# Altium schematic sheet misc_schem.SchDoc
size A4; SheetNumber: 2; SheetTotal: 2
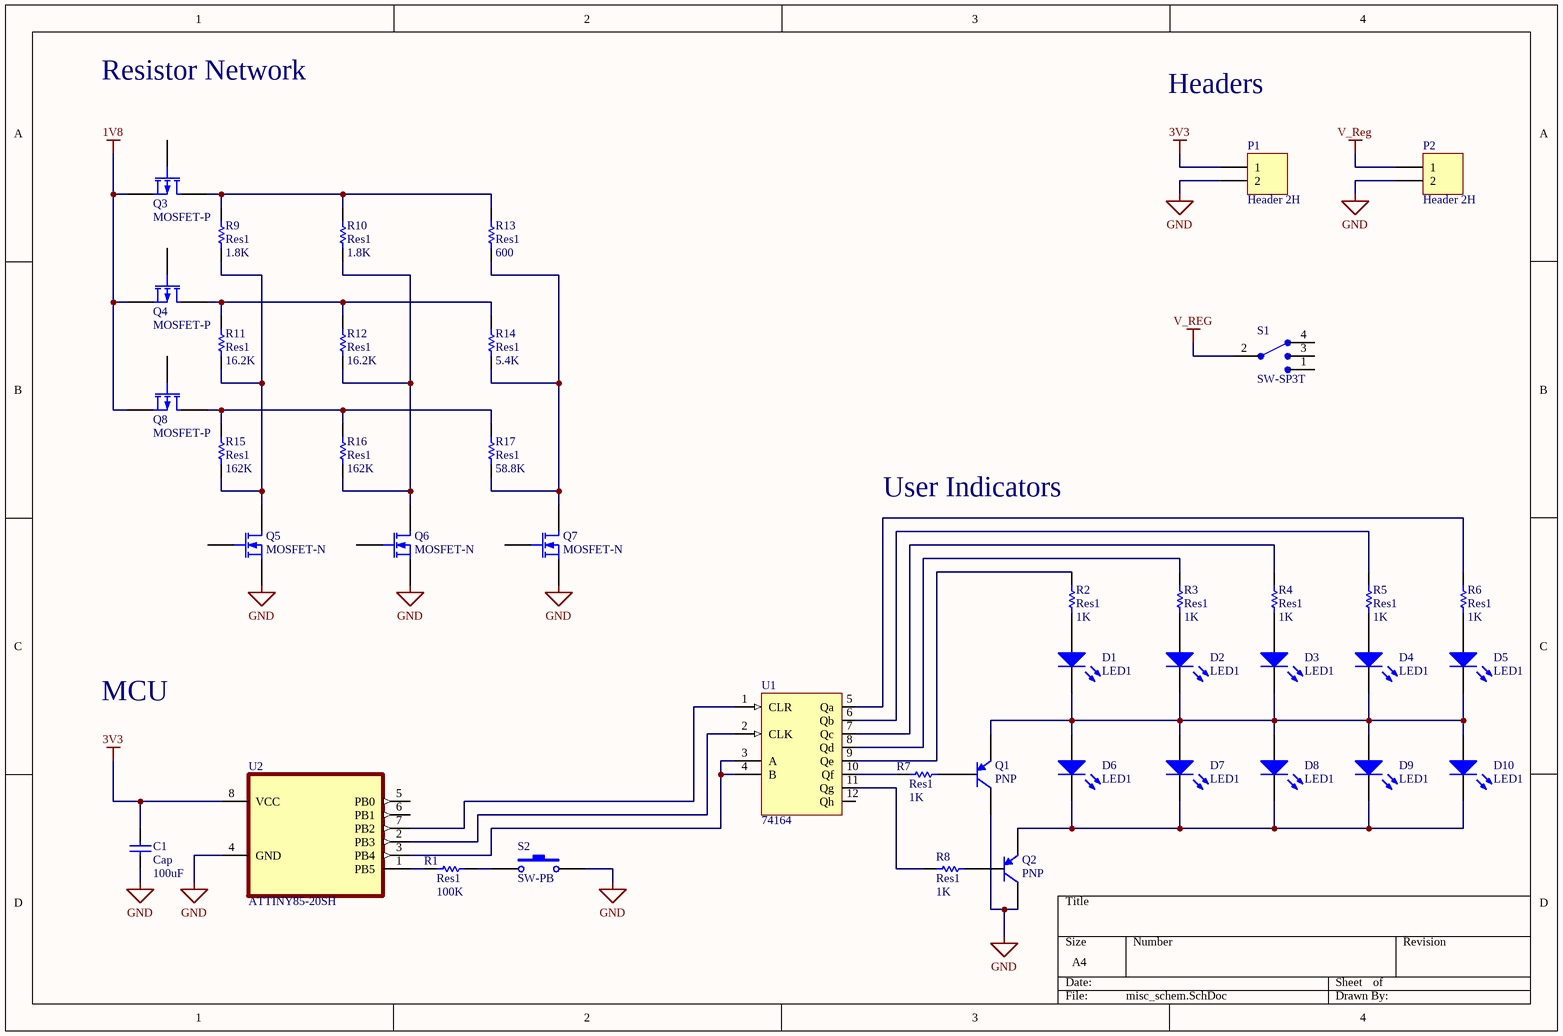
[diagram p0: misc_schem.SchDoc]

## Parts
C1  Cap  value 100uF  [RAD-0.3]
D1  LED1  [LED-1]
D2  LED1  [LED-1]
D3  LED1  [LED-1]
D4  LED1  [LED-1]
D5  LED1  [LED-1]
D6  LED1  [LED-1]
D7  LED1  [LED-1]
D8  LED1  [LED-1]
D9  LED1  [LED-1]
D10  LED1  [LED-1]
P1  Header 2H  [HDR1X2H]
P2  Header 2H  [HDR1X2H]
Q1  PNP  [SOT-23B_N]
Q2  PNP  [SOT-23B_N]
Q3  MOSFET-P  [E3]
Q4  MOSFET-P  [E3]
Q5  MOSFET-N  [E3]
Q6  MOSFET-N  [E3]
Q7  MOSFET-N  [E3]
Q8  MOSFET-P  [E3]
R1  Res1  value 100K  [AXIAL-0.3]
R2  Res1  value 1K  [AXIAL-0.3]
R3  Res1  value 1K  [AXIAL-0.3]
R4  Res1  value 1K  [AXIAL-0.3]
R5  Res1  value 1K  [AXIAL-0.3]
R6  Res1  value 1K  [AXIAL-0.3]
R7  Res1  value 1K  [AXIAL-0.3]
R8  Res1  value 1K  [AXIAL-0.3]
R9  Res1  value 1.8K  [AXIAL-0.3]
R10  Res1  value 1.8K  [AXIAL-0.3]
R11  Res1  value 16.2K  [AXIAL-0.3]
R12  Res1  value 16.2K  [AXIAL-0.3]
R13  Res1  value 600  [AXIAL-0.3]
R14  Res1  value 5.4K  [AXIAL-0.3]
R15  Res1  value 162K  [AXIAL-0.3]
R16  Res1  value 162K  [AXIAL-0.3]
R17  Res1  value 58.8K  [AXIAL-0.3]
S1  SW-SP3T  [SW_PCM13SMTR]
S2  SW-PB  [SPST-2]
U1  74164
U2  ATTINY85-20SH  [SOIC127P798X216-8N]

## Nets
1V8: Q3.3(S) Q4.3(S) Q8.3(S)
3V3: C1.2 P1.1 U2.8(VCC)
GND: C1.1 P1.2 P2.2 Q1.1(C) Q2.1(C) Q5.3(S) Q6.3(S) Q7.3(S) S2.2 U2.4(GND)
V_REG: P2.1 S1.2
NetD1_1: D1.1(A) R2.1
NetD1_2: D1.2(K) D2.2(K) D3.2(K) D4.2(K) D5.2(K) D6.1(A) D7.1(A) D8.1(A) D9.1(A) D10.1(A) Q1.3(E)
NetD2_1: D2.1(A) R3.1
NetD3_1: D3.1(A) R4.1
NetD4_1: D4.1(A) R5.1
NetD5_1: D5.1(A) R6.1
NetD6_2: D6.2(K) D7.2(K) D8.2(K) D9.2(K) D10.2(K) Q2.3(E)
NetQ1_2: Q1.2(B) R7.2
NetQ2_2: Q2.2(B) R8.2
NetQ3_1: Q3.1(D) R9.2 R10.2 R13.2
NetQ4_1: Q4.1(D) R11.2 R12.2 R14.2
NetQ5_1: Q5.1(D) R9.1 R11.1 R15.1
NetQ6_1: Q6.1(D) R10.1 R12.1 R16.1
NetQ7_1: Q7.1(D) R13.1 R14.1 R17.1
NetQ8_1: Q8.1(D) R15.2 R16.2 R17.2
NetR1_1: R1.1 U2.1(PB5)
NetR1_2: R1.2 S2.1
NetR2_2: R2.2 U1.9(Qe)
NetR3_2: R3.2 U1.8(Qd)
NetR4_2: R4.2 U1.7(Qc)
NetR5_2: R5.2 U1.6(Qb)
NetR6_2: R6.2 U1.5(Qa)
NetR7_1: R7.1 U1.10(Qf)
NetR8_1: R8.1 U1.11(Qg)
NetU1_1: U1.1(CLR) U2.7(PB2)
NetU1_2: U1.2(CLK) U2.2(PB3)
NetU1_3: U1.3(A) U1.4(B) U2.3(PB4)

Not connected (* = marked no-connect by the designer): Q3 2(G); Q4 2(G); Q5 2(G); Q6 2(G); Q7 2(G); Q8 2(G); S1 1 3 4; U1 12(Qh); U2 5(PB0) 6(PB1)

## Notes on the sheet
- Resistor Network
- Headers
- User Indicators
- MCU

## Library data of the parts
C1 = Cap: Capacitor; Published: 8-Jun-2000; LatestRevisionDate: 17-Jul-2002; LatestRevisionNote: Re-released for DXP Platform.; PackageReference: RAD-0.3; Publisher: Altium Limited; PackageDescription: Radial Cap, Thru-Hole; 2 Leads; 0.3 in Pin Spacing
D1-D10 = LED1: Typical RED GaAs LED; Published: 8-Jun-2000; LatestRevisionDate: 08-Jul-2005; LatestRevisionNote: Mech Layer 1 removed.; PackageReference: LED-1; Publisher: Altium Limited; PackageDescription: LED; 2 Leads
P1 P2 = Header 2H: Header, 2-Pin, Right Angle; LatestRevisionDate: 17-Jul-2002; LatestRevisionNote: Re-released for DXP Platform.; Publisher: Altium Limited
Q1 Q2 = PNP: PNP Bipolar Transistor; Published: 8-Jun-2000; LatestRevisionDate: 29-May-2009; LatestRevisionNote: IPC-7351 Footprint Added.; PackageVersion: Aug-1999; PackageReference: SOT-23B; Publisher: Altium Limited; PackageDescription: 3-Pin SOT-23 Package 0.95 mm Pitch, 2.4 mm Lead Span
Q3 Q4 Q8 = MOSFET-P: P-Channel MOSFET; Published: 8-Jun-2000; LatestRevisionDate: 17-Jul-2002; LatestRevisionNote: Re-released for DXP Platform.; PackageVersion: 1995/1996; PackageReference: E3; Publisher: Altium Limited; PackageDescription: TO, Flat Index; 3 In-Line, Axial Leads; Body Dia. 4.6mm; Lead Dia. 0.5 mm (max)
Q5-Q7 = MOSFET-N: N-Channel MOSFET; Published: 8-Jun-2000; LatestRevisionDate: 17-Jul-2002; LatestRevisionNote: Re-released for DXP Platform.; PackageVersion: 1995/1996; PackageReference: E3; Publisher: Altium Limited; PackageDescription: TO, Flat Index; 3 In-Line, Axial Leads; Body Dia. 4.6mm; Lead Dia. 0.5 mm (max)
R1-R17 = Res1: Resistor; Published: 8-Jun-2000; LatestRevisionDate: 17-Jul-2002; LatestRevisionNote: Re-released for DXP Platform.; PackageReference: AXIAL-0.3; Publisher: Altium Limited; PackageDescription: Axial Device, Thru-Hole; 2 Leads; 0.3 in Pin Spacing
S1 = SP3T: SP3T Subminiature Toggle Switch, Right Angle Mounting, Vertical Actuation; MP: PCM13SMTR; MF: C&K; Value: *; SnapEDA_Link: https://www.snapeda.com/parts/PCM13SMTR/C%26K/view-part/392684/?ref=snap; Availability: Unavailable; Package: None; Price: None
S2 = SW-PB: Switch; Published: 24-Mar-1999; LatestRevisionDate: 17-Jul-2002; LatestRevisionNote: Re-released for DXP Platform.; PackageReference: SPST-2; Publisher: Altium Limited; PackageDescription: Switch; 2 Leads
U1 = 74HC164: 8-Bit Shift Register
U2 = ATTINY85-20SH: AVR ATtiny Microcontroller IC 8-Bit 20MHz 8KB _4K x 16_ FLASH 8-SOIC; MF: Microchip; Availability: Unavailable; MP: ATTINY85-20SH; SnapEDA_Link: https://www.snapeda.com/parts/ATTINY85-20SH/Microchip/view-part/641442/?ref=snap; Value: *; Price: None; Package: SOIC-8 Microchip